# Altium project ZT101-STC8H8K64U.PrjPcb
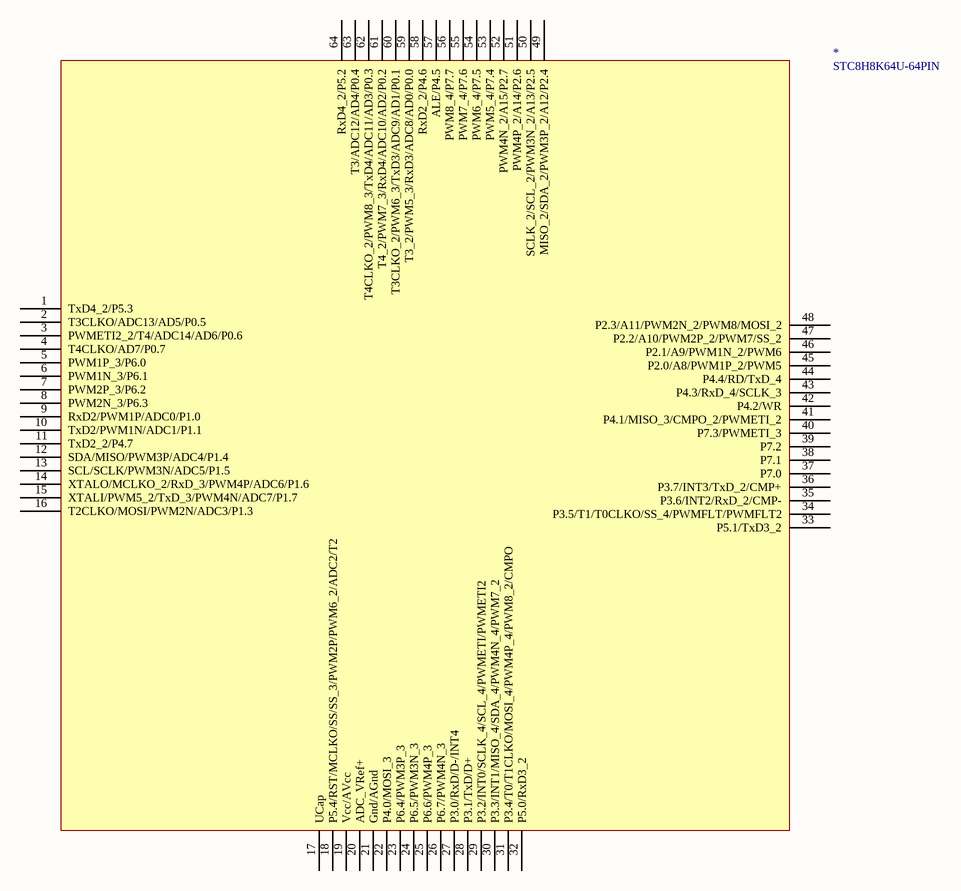
[diagram p0: STC8H8K64U.SchDoc]
1 sheet, 1 parts. Net scope: global (net labels, ports and power ports of the same name join across sheets).
Board file: STC8H8K64U.PcbDoc

## Sheet STC8H8K64U.SchDoc
size A1

### Parts
*  STC8H8K64U-64PIN  [LQFP64S]

### Nets

Not connected (* = marked no-connect by the designer): * 1(TxD4_2/P5.3) 2(T3CLKO/ADC13/AD5/P0.5) 3(PWMETI2_2/T4/ADC14/AD6/P0.6) 4(T4CLKO/AD7/P0.7) 5(PWM1P_3/P6.0) 6(PWM1N_3/P6.1) 7(PWM2P_3/P6.2) 8(PWM2N_3/P6.3) 9(RxD2/PWM1P/ADC0/P1.0) 10(TxD2/PWM1N/ADC1/P1.1) 11(TxD2_2/P4.7) 12(SDA/MISO/PWM3P/ADC4/P1.4) 13(SCL/SCLK/PWM3N/ADC5/P1.5) 14(XTALO/MCLKO_2/RxD_3/PWM4P/ADC6/P1.6) 15(XTALI/PWM5_2/TxD_3/PWM4N/ADC7/P1.7) 16(T2CLKO/MOSI/PWM2N/ADC3/P1.3) 17(UCap) 18(P5.4/RST/MCLKO/SS/SS_3/PWM2P/PWM6_2/ADC2/T2) 19(Vcc/AVcc) 20(ADC_VRef+) 21(Gnd/AGnd) 22(P4.0/MOSI_3) 23(P6.4/PWM3P_3) 24(P6.5/PWM3N_3) 25(P6.6/PWM4P_3) 26(P6.7/PWM4N_3) 27(P3.0/RxD/D-/INT4) 28(P3.1/TxD/D+) 29(P3.2/INT0/SCLK_4/SCL_4/PWMETI/PWMETI2) 30(P3.3/INT1/MISO_4/SDA_4/PWM4N_4/PWM7_2) 31(P3.4/T0/T1CLKO/MOSI_4/PWM4P_4/PWM8_2/CMPO) 32(P5.0/RxD3_2) 33(P5.1/TxD3_2) 34(P3.5/T1/T0CLKO/SS_4/PWMFLT/PWMFLT2) 35(P3.6/INT2/RxD_2/CMP-) 36(P3.7/INT3/TxD_2/CMP+) 37(P7.0) 38(P7.1) 39(P7.2) 40(P7.3/PWMETI_3) 41(P4.1/MISO_3/CMPO_2/PWMETI_2) 42(P4.2/WR) 43(P4.3/RxD_4/SCLK_3) 44(P4.4/RD/TxD_4) 45(P2.0/A8/PWM1P_2/PWM5) 46(P2.1/A9/PWM1N_2/PWM6) 47(P2.2/A10/PWM2P_2/PWM7/SS_2) 48(P2.3/A11/PWM2N_2/PWM8/MOSI_2) 49(MISO_2/SDA_2/PWM3P_2/A12/P2.4) 50(SCLK_2/SCL_2/PWM3N_2/A13/P2.5) 51(PWM4P_2/A14/P2.6) 52(PWM4N_2/A15/P2.7) 53(PWM5_4/P7.4) 54(PWM6_4/P7.5) 55(PWM7_4/P7.6) 56(PWM8_4/P7.7) 57(ALE/P4.5) 58(RxD2_2/P4.6) 59(T3_2/PWM5_3/RxD3/ADC8/AD0/P0.0) 60(T3CLKO_2/PWM6_3/TxD3/ADC9/AD1/P0.1) 61(T4_2/PWM7_3/RxD4/ADC10/AD2/P0.2) 62(T4CLKO_2/PWM8_3/TxD4/ADC11/AD3/P0.3) 63(T3/ADC12/AD4/P0.4) 64(RxD4_2/P5.2)